# EAGLE design STorM32 NT ESP8266 module v005 (EAGLE 7.5.0)
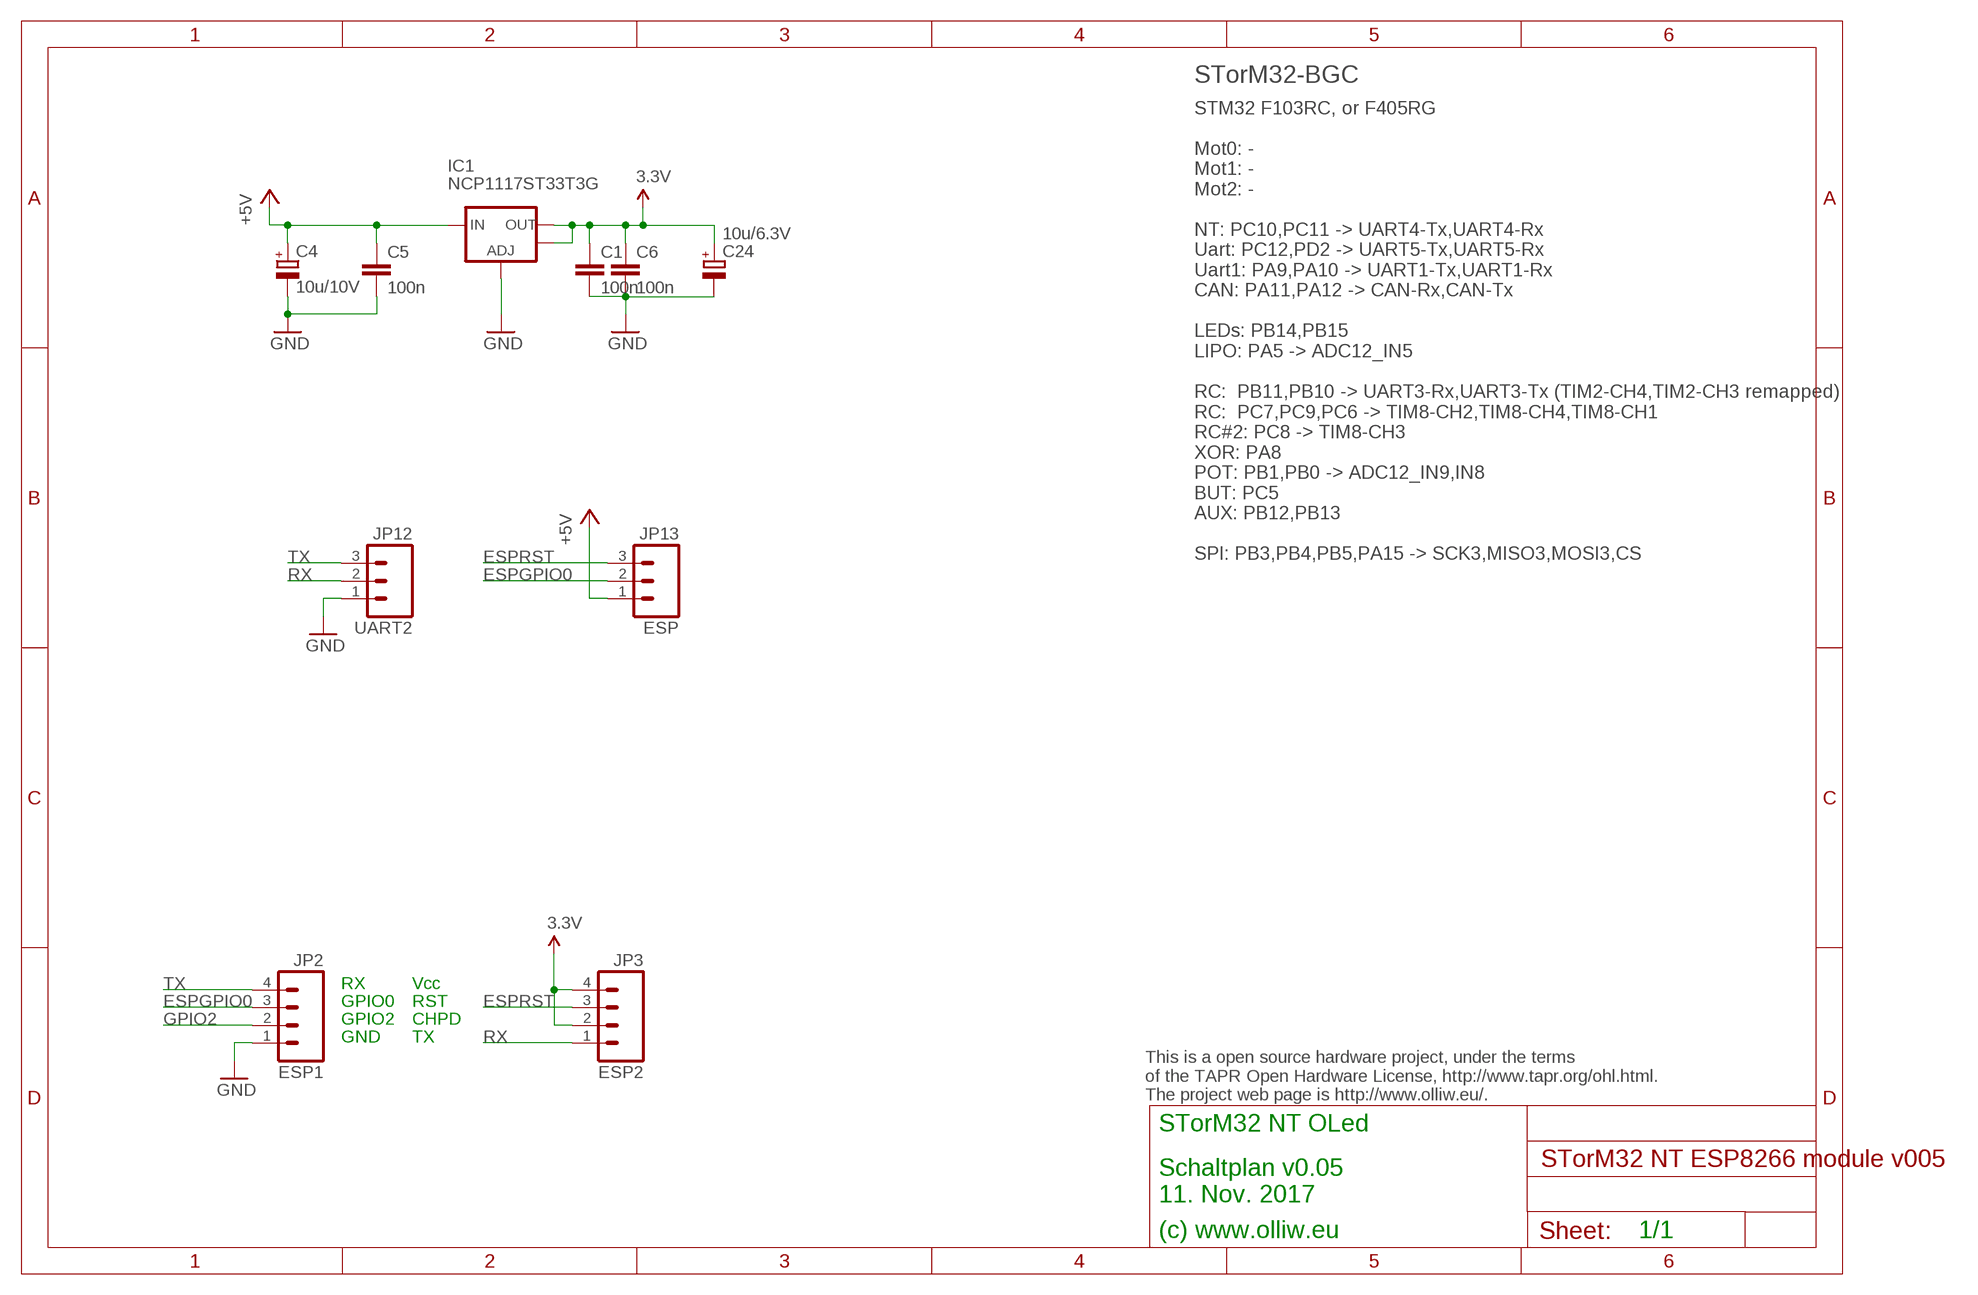
[diagram p0: schematic, sheet 1]

## Parts
C1  100n  C-EUC0603  [C0603]
C4  10u/10V  CPOL-EUSMCA  [SMC_A]
C5  100n  C-EUC0603  [C0603]
C6  100n  C-EUC0603  [C0603]
C24  10u/6.3V  CPOL-EUSMCB  [SMC_B]
IC1  NCP1117ST33T3G  V_REG_LM1117SOT223  [SOT223]
JP2  ESP1  M041X04_NO_SILK  [1X04_NO_SILK]
JP3  ESP2  M041X04_NO_SILK  [1X04_NO_SILK]
JP12  UART2  M031X03_NO_SILK  [1X03_NO_SILK]
JP13  ESP  M031X03_NO_SILK  [1X03_NO_SILK]

## Nets
3.3V: C1.1 C6.1 C24.+ IC1.2(OUT) IC1.4(OUT) JP3.2 JP3.4
+5V: C4.+ C5.1 IC1.3(IN) JP13.1
ESPGPIO0: JP2.3 JP13.2
ESPRST: JP3.3 JP13.3
GND: C1.2 C4.- C5.2 C6.2 C24.- IC1.1(ADJ) JP2.1 JP12.1
GPIO2: JP2.2
RX: JP3.1 JP12.2
TX: JP2.4 JP12.3

## Notes on the sheet
- STorM32-BGC
- STM32 F103RC, or F405RG
  
  Mot0: -
  Mot1: -
  Mot2: -
  
  NT: PC10,PC11 -> UART4-Tx,UART4-Rx
  Uart: PC12,PD2 -> UART5-Tx,UART5-Rx
  Uart1: PA9,PA10 -> UART1-Tx,UART1-Rx
  CAN: PA11,PA12 -> CAN-Rx,CAN-Tx
  
  LEDs: PB14,PB15
  LIPO: PA5 -> ADC12_IN5
  
  RC:  PB11,PB10 -> UART3-Rx,UART3-Tx (TIM2-CH4,TIM2-CH3 remapped)
  RC:  PC7,PC9,PC6 -> TIM8-CH2,TIM8-CH4,TIM8-CH1
  RC#2: PC8 -> TIM8-CH3
  XOR: PA8
  POT: PB1,PB0 -> ADC12_IN9,IN8
  BUT: PC5
  AUX: PB12,PB13
  
  SPI: PB3,PB4,PB5,PA15 -> SCK3,MISO3,MOSI3,CS
- RX | Vcc
- GPIO0 | RST
- GPIO2 | CHPD
- GND | TX
- This is a open source hardware project, under the terms
  of the TAPR Open Hardware License, http://www.tapr.org/ohl.html.
  The project web page is http://www.olliw.eu/.
- STorM32 NT OLed
- Schaltplan v0.05
  11. Nov. 2017
- (c) www.olliw.eu | 1/1

## Library data of the parts
C1 C5 C6 = rcl:C-EU: CAPACITOR, European symbol
C4 C24 = rcl:CPOL-EU: POLARIZED CAPACITOR, European symbol
IC1 = # SparkFun2:V_REG_LM1117: Voltage Regulator LM1117 Standard adjustable voltage regulator but in SMD form. Spark Fun Electronics SKU : COM-00595
JP2 JP3 = # SparkFun2:M04: Header 4 Standard 4-pin 0.1" header. Use with straight break away headers (SKU : PRT-00116), right angle break away headers (PRT-00553), swiss pins (PRT-00743), machine pins (PRT-00117), and female headers (PRT-00115). Molex polarized connector foot print use with SKU : PRT-08231 with associated crimp pins and housings. 1MM SMD Version SKU: PRT-10208
JP12 JP13 = # SparkFun2:M03: Header 3 Standard 3-pin 0.1" header. Use with straight break away headers (SKU : PRT-00116), right angle break away headers (PRT-00553), swiss pins (PRT-00743), machine pins (PRT-00117), and female headers (PRT-00115). Molex polarized connector foot print use with SKU : PRT-08232 with associated crimp pins and housings.

## Board
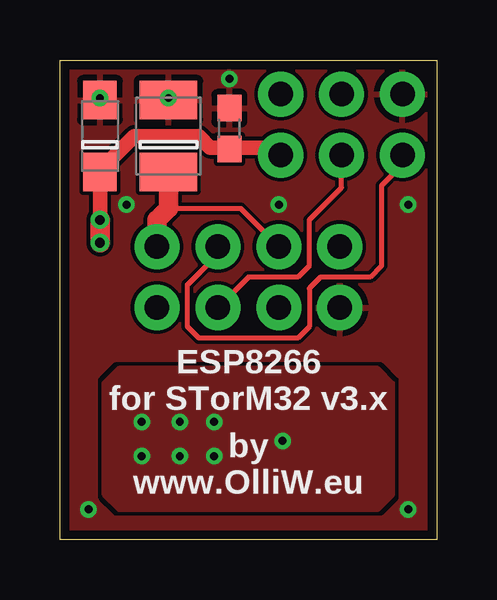
[diagram p1: board, top side]
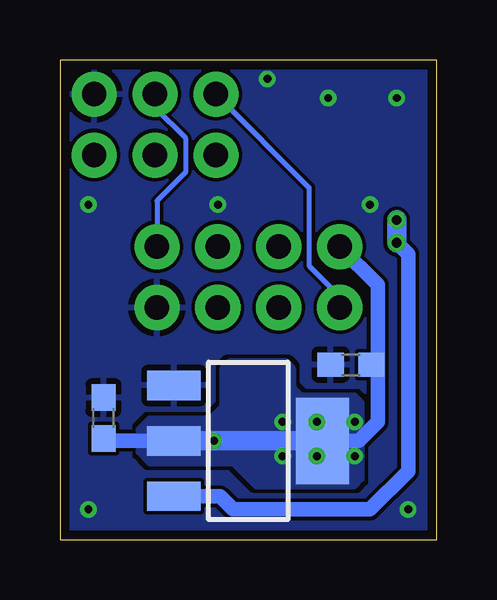
[diagram p2: board, bottom side, seen from below]

Size 15.71 x 20 mm. Coordinates in mm from the lower left corner, seen from the top.
Outline: 15.71,0 0,0 0,20 15.71,20 15.71,0
Copper layers (1*16): Top 0.0356mm / dielectric 1.5011mm / Bottom 0.0356mm
Design rules "ow-oshpark-2layer": minimum track width 6mil, minimum drill 13mil, track to track 6mil, track to pad 6mil, pad to pad 6mil, via to via 6mil, smd to smd 6mil, copper to edge 15mil, drill to drill 6mil, minimum pad ring 7mil, minimum via ring 7mil, stop-mask expansion 2.5mil, vias tented up to drill 26mil, thermal gap 10mil

### Footprints (pad centres in the part's own frame; a part is rotated, then mirrored left to right if it is on the bottom)
C0603 = smd 1.1 x 1: 1 -0.85,0; 2 0.85,0
SMC_A = smd 1.6 x 1.4: + -1.5,0; - 1.5,0
SMC_B = smd 1.6 x 2.4: + -1.5,0; - 1.5,0
SOT223 = smd 1.219 x 2.235: 1 -2.311,-3.099; 2 0,-3.099; 3 2.311,-3.099 | smd 3.6 x 2.2: 4 0,3.099
1X04_NO_SILK = drill 1.016 pad 1.88: 1 0,0; 2 2.54,0; 3 5.08,0; 4 7.62,0
1X03_NO_SILK = drill 1.016 pad 1.88: 1 0,0; 2 2.54,0; 3 5.08,0

### Placement (x,y rotation side)
C1  3.57,7.3 180 bottom
C4  1.67,16.83 90 top
C5  7.06,17.14 90 top
C6  13.89,5.08 90 bottom
C24  4.52,16.83 90 top
IC1  7.86,4.13 270 bottom
JP2  11.67,9.68 180 top
JP3  11.67,12.22 180 top
JP12  14.29,18.57 180 top
JP13  9.21,16.03 0 top

### Tracks (layer width: path | path; a pad name or v marks a point on that pad's centre or on a via)
3.3V  (via drill 0.33)
  Top 0.203: 4.52,13.81 7.54,13.81 JP3.2
  Top 0.813: JP3.4 4.05,13.33 4.52,13.81 C24.+
  Bottom 0.203: 13.79,4.13 C6.1
  Bottom 0.406: C1.1 2.46,7.3
  Bottom 0.61: IC1.2 13.79,4.13 | IC1.4 3.25,4.13 2.46,4.92 2.46,7.3 2.46,10.64 JP3.4
  Bottom 0.813: IC1.2 IC1.4
  other vias: 5,4.92 5,3.49 3.41,4.92 3.41,3.49 9.29,4.13 6.43,4.92 6.43,3.49
  pour Bottom (no thermals): 3.1,5.71 3.41,6.03 5.64,6.03 5.95,6.35 5.95,7.14 6.27,7.46 8.65,7.46 8.97,7.14 8.97,5.56 9.45,5.08 11.99,5.08 12.46,4.6 12.46,3.65 11.99,3.17 8.49,3.17 7.54,2.22 3.41,2.22 3.1,2.54
  pour Top: 2.46,7.14 1.83,6.51 1.83,1.9 2.46,1.27 13.26,1.27 13.89,1.9 13.89,6.51 13.26,7.14
+5V  (via drill 0.4)
  Top 0.406: 7.17,16.35 C5.1
  Top 0.61: v1.67,13.33 C4.+ 1.67,15.4 3.1,16.83 5.79,16.83 6.27,16.35 7.17,16.35 8.89,16.35 JP13.1
  Top 0.813: v1.67,12.38 v1.67,13.33
  Bottom 0.61: IC1.3 9.04,1.82 8.49,1.27 2.78,1.27 1.19,2.86 1.19,11.91 v1.67,12.38
  Bottom 0.813: v1.67,12.38 v1.67,13.33
ESPGPIO0
  Top 0.203: JP2.3 7.86,10.95 9.92,10.95 10.4,11.43 10.4,13.33 11.75,14.68 JP13.2
ESPRST
  Top 0.203: JP13.3 14.29,15.64 13.41,14.76 13.41,11.43 12.94,10.95 10.87,10.95 10.4,10.48 10.4,8.89 9.92,8.41 5.79,8.41 5.32,8.89 5.32,10.64 6.59,11.91 JP3.3
GND  (via drill 0.33)
  other vias: 2.78,13.97 14.53,13.97 14.53,1.27 1.19,1.27 4.52,18.41 1.67,18.41 9.13,13.97 7.06,19.21
  pour Top (isolate 0.152, rank 6): -0.24,-0.16 -0.24,20.16 15.95,20.15 15.95,-0.16
  pour Bottom (isolate 0.152, rank 6): -0.24,-0.16 -0.24,20.16 15.95,20.15 15.95,-0.16
RX
  Bottom 0.203: JP12.2 11.75,18.02 10.48,16.75 10.48,15.32 11.67,14.13 JP3.1
TX
  Bottom 0.203: JP2.4 4.05,10.16 5.32,11.43 5.32,14.68 JP12.3

### Text on the board
tNames: ESP8266 / for STorM32 v3.x | by / www.OlliW.eu